# EAGLE design WM (EAGLE 8.1.0)

## Sheet 1 of 3
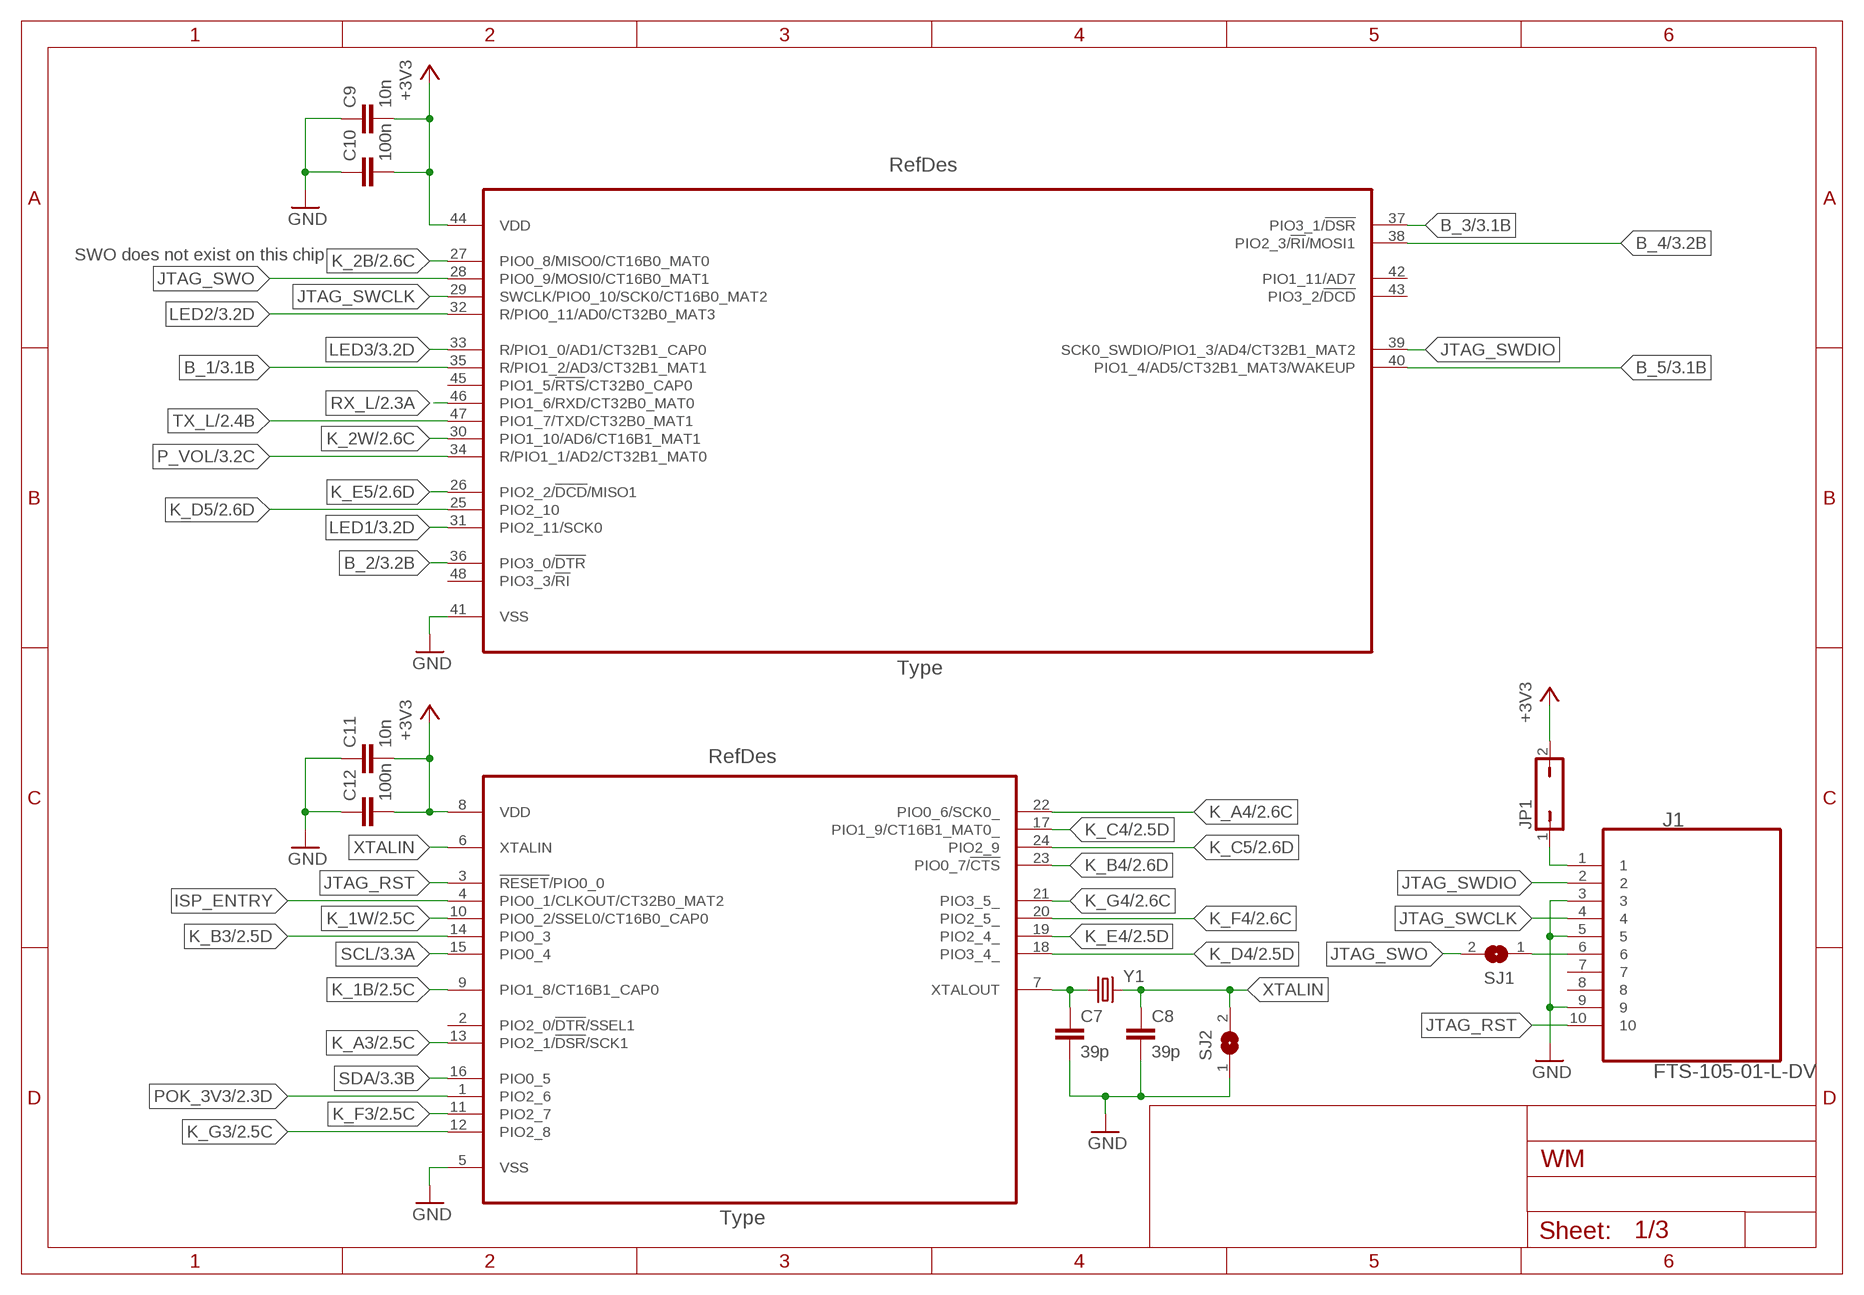
[diagram p0: schematic, sheet 1]

### Parts
C7  39p  C-EUC0805  [C0805]
C8  39p  C-EUC0805  [C0805]
C9  10n  C-EUC0805  [C0805]
C10  100n  C-EUC0805  [C0805]
C11  10n  C-EUC0805  [C0805]
C12  100n  C-EUC0805  [C0805]
J1  FTS-105-01-L-DV  [SAMTEC_FTS-105-01-L-DV]
JP1  JP1Q  [JP1]
SJ1  SJ  [SJ]
SJ2  SJ  [SJ]
U1  LPC1113FBD48/302,1  [QFP50P900X900X160-48N]
Y1  CRYSTALHC49UP  [HC49UP]

### Nets
+3V3: C9.2 C10.2 C11.2 C12.2 JP1.2 U1.8(A:VDD) U1.44(B:VDD) ; also sheet 2,3
B_1: U1.35(B:R/PIO1_2/AD3/CT32B1_MAT1) ; also sheet 3
B_2: U1.36(B:PIO3_0/!DTR!) ; also sheet 3
B_3: U1.37(B:PIO3_1/!DSR!) ; also sheet 3
B_4: U1.38(B:PIO2_3/!RI!/MOSI1) ; also sheet 3
B_5: U1.40(B:PIO1_4/AD5/CT32B1_MAT3/WAKEUP) ; also sheet 3
GND: C7.2 C8.2 C9.1 C10.1 C11.1 C12.1 J1.3 J1.5 J1.9 SJ2.1 U1.5(A:VSS) U1.41(B:VSS) ; also sheet 2,3
ISP_ENTRY: U1.4(A:PIO0_1/CLKOUT/CT32B0_MAT2)
JTAG_RST: J1.10 U1.3(A:!RESET!/PIO0_0)
JTAG_SWCLK: J1.4 U1.29(B:SWCLK/PIO0_10/SCK0/CT16B0_MAT2)
JTAG_SWDIO: J1.2 U1.39(B:SCK0_SWDIO/PIO1_3/AD4/CT32B1_MAT2)
JTAG_SWO: SJ1.2 U1.28(B:PIO0_9/MOSI0/CT16B0_MAT1)
K_1B: U1.9(A:PIO1_8/CT16B1_CAP0) ; also sheet 2,3
K_1W: U1.10(A:PIO0_2/SSEL0/CT16B0_CAP0) ; also sheet 2,3
K_2B: U1.27(B:PIO0_8/MISO0/CT16B0_MAT0) ; also sheet 2,3
K_2W: U1.30(B:PIO1_10/AD6/CT16B1_MAT1) ; also sheet 2,3
K_A3: U1.13(A:PIO2_1/!DSR!/SCK1) ; also sheet 2,3
K_A4: U1.22(A:PIO0_6/SCK0_) ; also sheet 2,3
K_B3: U1.14(A:PIO0_3) ; also sheet 2,3
K_B4: U1.23(A:PIO0_7/!CTS!) ; also sheet 2,3
K_C4: U1.17(A:PIO1_9/CT16B1_MAT0_) ; also sheet 2,3
K_C5: U1.24(A:PIO2_9) ; also sheet 2,3
K_D4: U1.18(A:PIO3_4_) ; also sheet 2,3
K_D5: U1.25(B:PIO2_10) ; also sheet 2,3
K_E4: U1.19(A:PIO2_4_) ; also sheet 2,3
K_E5: U1.26(B:PIO2_2/!DCD!/MISO1) ; also sheet 2,3
K_F3: U1.11(A:PIO2_7) ; also sheet 2,3
K_F4: U1.20(A:PIO2_5_) ; also sheet 2,3
K_G3: U1.12(A:PIO2_8) ; also sheet 2,3
K_G4: U1.21(A:PIO3_5_) ; also sheet 2,3
LED1: U1.31(B:PIO2_11/SCK0) ; also sheet 3
LED2: U1.32(B:R/PIO0_11/AD0/CT32B0_MAT3) ; also sheet 3
LED3: U1.33(B:R/PIO1_0/AD1/CT32B1_CAP0) ; also sheet 3
N$13: C7.1 U1.7(A:XTALOUT) Y1.1
N$15: J1.1 JP1.1
N$16: J1.6 SJ1.1
P_VOL: U1.34(B:R/PIO1_1/AD2/CT32B1_MAT0) ; also sheet 3
POK_3V3: U1.1(A:PIO2_6) ; also sheet 2
RX_L: U1.46(B:PIO1_6/RXD/CT32B0_MAT0) ; also sheet 2
SCL: U1.15(A:PIO0_4) ; also sheet 3
SDA: U1.16(A:PIO0_5) ; also sheet 3
TX_L: U1.47(B:PIO1_7/TXD/CT32B0_MAT1) ; also sheet 2
XTALIN: C8.1 SJ2.2 U1.6(A:XTALIN) Y1.2
Unconnected: J1.7 J1.8 U1.2(A:PIO2_0/!DTR!/SSEL1) U1.42(B:PIO1_11/AD7) U1.43(B:PIO3_2/!DCD!) U1.45(B:PIO1_5/!RTS!/CT32B0_CAP0) U1.48(B:PIO3_3/!RI!)

### Notes on the sheet
- SWO does not exist on this chip

## Sheet 2 of 3
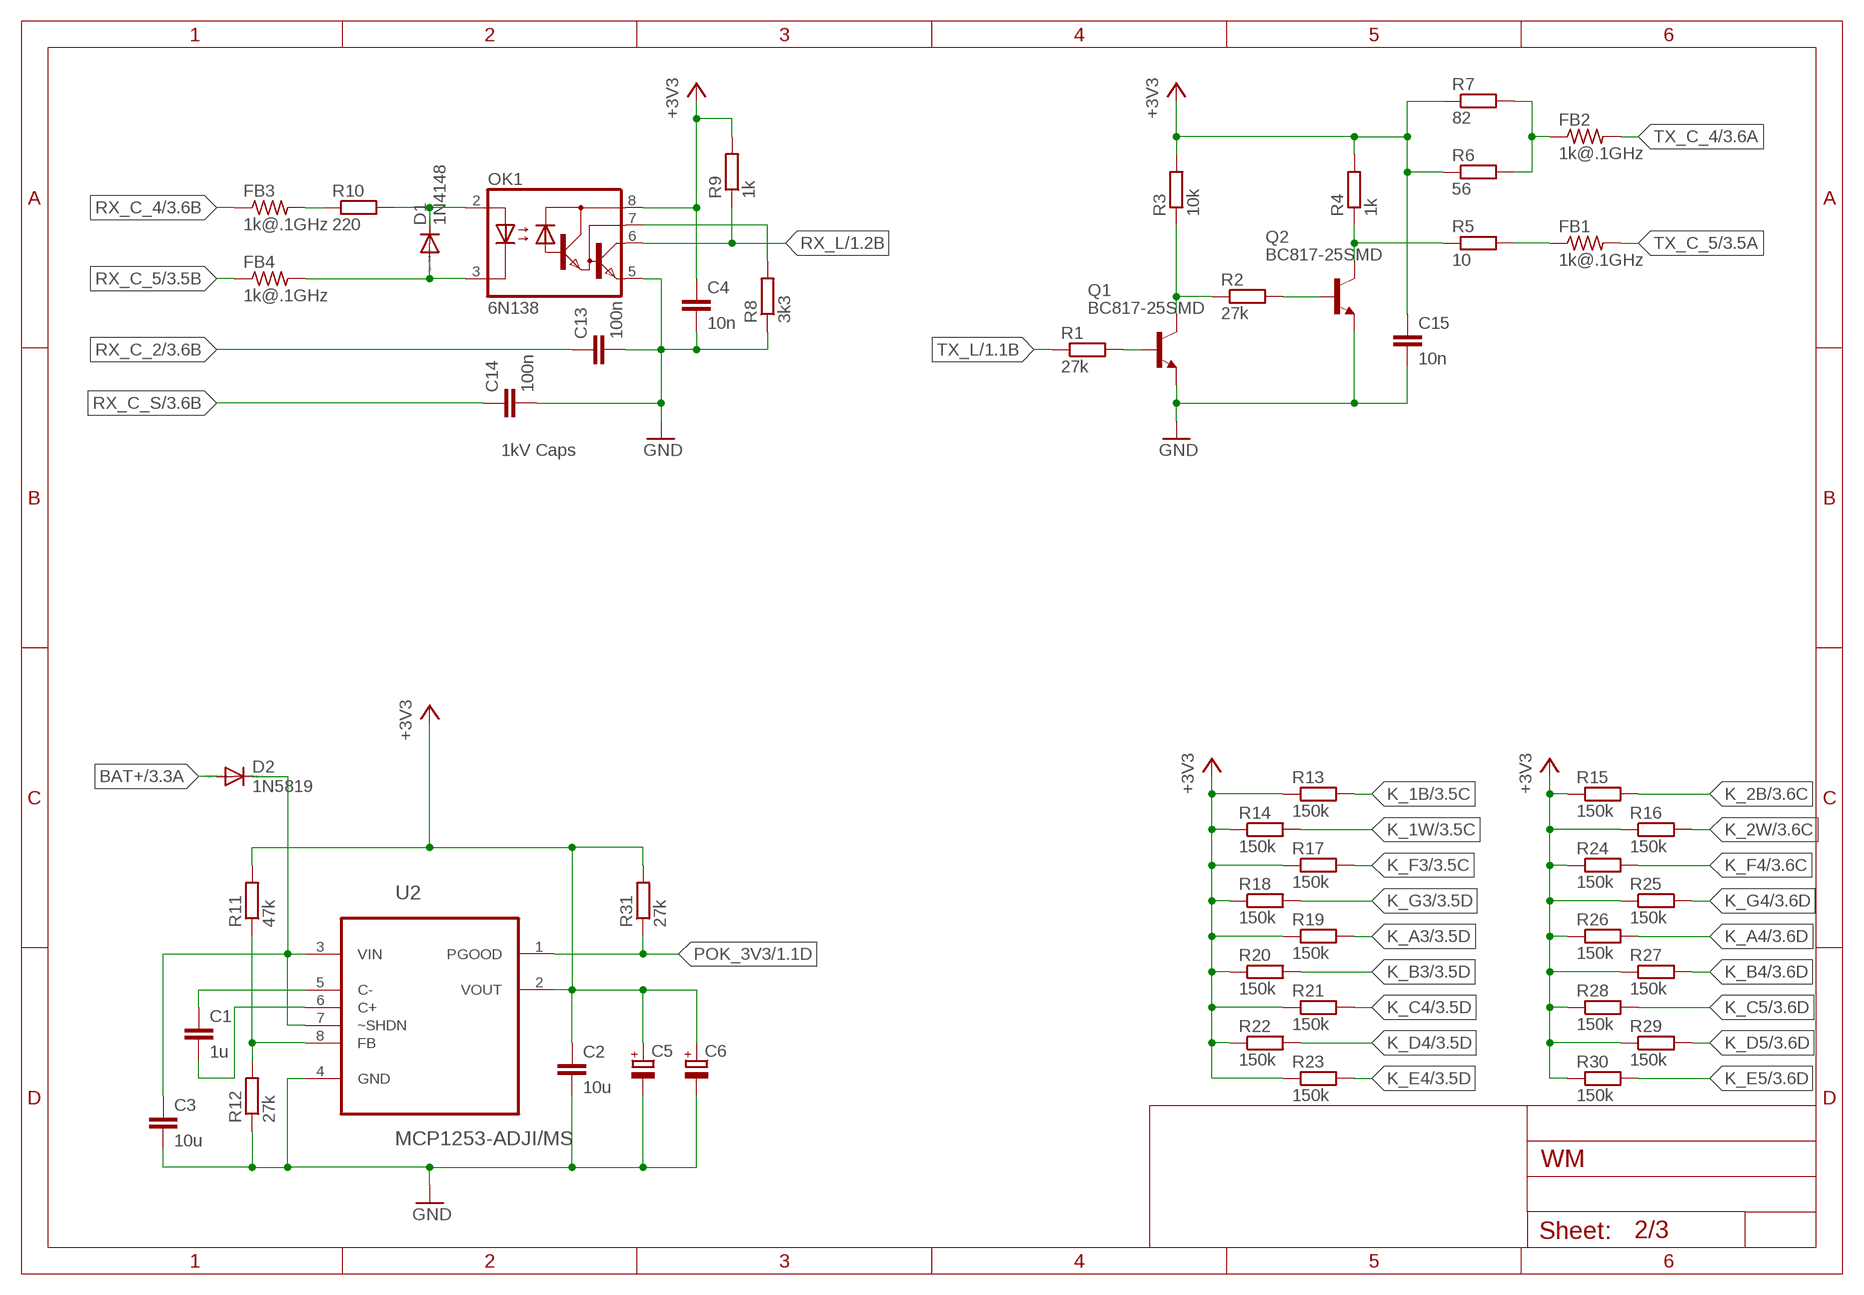
[diagram p1: schematic, sheet 2]

### Parts
C1  1u  C-EUC0805  [C0805]
C2  10u  C-EUC0805  [C0805]
C3  10u  C-EUC0805  [C0805]
C4  10n  C-EUC0805  [C0805]
C5  CPOL-EUE2.5-6  [E2,5-6]
C6  CPOL-EUE2.5-6  [E2,5-6]
C13  100n  C-EUC1210K  [C1210K]
C14  100n  C-EUC1210K  [C1210K]
C15  10n  C-EUC0805  [C0805]
D1  1N4148  DIODE-SOD323-R  [SOD323-R]
D2  1N5819  DIODE-SOD123  [SOD123]
FB1  1k@.1GHz  R-US_R0805  [R0805]
FB2  1k@.1GHz  R-US_R0805  [R0805]
FB3  1k@.1GHz  R-US_R0805  [R0805]
FB4  1k@.1GHz  R-US_R0805  [R0805]
OK1  6N138  [DIL08]
Q1  BC817-25SMD  [SOT23-BEC]
Q2  BC817-25SMD  [SOT23-BEC]
R1  27k  R-EU_R0805  [R0805]
R2  27k  R-EU_R0805  [R0805]
R3  10k  R-EU_R0805  [R0805]
R4  1k  R-EU_R0805  [R0805]
R5  10  R-EU_R0805  [R0805]
R6  56  R-EU_R0805  [R0805]
R7  82  R-EU_R0805  [R0805]
R8  3k3  R-EU_R0805  [R0805]
R9  1k  R-EU_R0805  [R0805]
R10  220  R-EU_R0805  [R0805]
R11  47k  R-EU_R0805  [R0805]
R12  27k  R-EU_R0805  [R0805]
R13  150k  R-EU_R0805  [R0805]
R14  150k  R-EU_R0805  [R0805]
R15  150k  R-EU_R0805  [R0805]
R16  150k  R-EU_R0805  [R0805]
R17  150k  R-EU_R0805  [R0805]
R18  150k  R-EU_R0805  [R0805]
R19  150k  R-EU_R0805  [R0805]
R20  150k  R-EU_R0805  [R0805]
R21  150k  R-EU_R0805  [R0805]
R22  150k  R-EU_R0805  [R0805]
R23  150k  R-EU_R0805  [R0805]
R24  150k  R-EU_R0805  [R0805]
R25  150k  R-EU_R0805  [R0805]
R26  150k  R-EU_R0805  [R0805]
R27  150k  R-EU_R0805  [R0805]
R28  150k  R-EU_R0805  [R0805]
R29  150k  R-EU_R0805  [R0805]
R30  150k  R-EU_R0805  [R0805]
R31  27k  R-EU_R0805  [R0805]
U2  MCP1253-ADJI/MS  [SOP65P490X118-8N]

### Nets
+3V3: C2.1 C4.1 C5.+ C6.+ C15.1 OK1.8(VCC) R3.2 R4.2 R6.1 R7.1 R9.2 R11.2 R13.1 R14.1 R15.1 R16.1 R17.1 R18.1 R19.1 R20.1 R21.1 R22.1 R23.1 R24.1 R25.1 R26.1 R27.1 R28.1 R29.1 R30.1 R31.2 U2.2(VOUT) ; also sheet 1,3
BAT+: D2.A ; also sheet 3
GND: C2.2 C3.2 C4.2 C5.- C6.- C13.2 C14.2 C15.2 OK1.5(GND) Q1.E Q2.E R8.1 R12.1 U2.4(GND) ; also sheet 1,3
K_1B: R13.2 ; also sheet 1,3
K_1W: R14.2 ; also sheet 1,3
K_2B: R15.2 ; also sheet 1,3
K_2W: R16.2 ; also sheet 1,3
K_A3: R19.2 ; also sheet 1,3
K_A4: R26.2 ; also sheet 1,3
K_B3: R20.2 ; also sheet 1,3
K_B4: R27.2 ; also sheet 1,3
K_C4: R21.2 ; also sheet 1,3
K_C5: R28.2 ; also sheet 1,3
K_D4: R22.2 ; also sheet 1,3
K_D5: R29.2 ; also sheet 1,3
K_E4: R23.2 ; also sheet 1,3
K_E5: R30.2 ; also sheet 1,3
K_F3: R17.2 ; also sheet 1,3
K_F4: R24.2 ; also sheet 1,3
K_G3: R18.2 ; also sheet 1,3
K_G4: R25.2 ; also sheet 1,3
N$1: Q1.B R1.2
N$2: Q1.C R2.1 R3.1
N$3: Q2.B R2.2
N$4: Q2.C R4.1 R5.1
N$5: OK1.7(VB) R8.2
N$6: C1.1 U2.5(C-)
N$7: D1.C OK1.2(A) R10.2
N$8: C1.2 U2.6(C+)
N$10: R11.1 R12.2 U2.8(FB)
N$17: FB3.2 R10.1
N$18: D1.A FB4.2 OK1.3(C)
N$19: FB1.1 R5.2
POK_3V3: R31.1 U2.1(PGOOD) ; also sheet 1
RX_C_2: C13.1 ; also sheet 3
RX_C_4: FB3.1 ; also sheet 3
RX_C_5: FB4.1 ; also sheet 3
RX_C_S: C14.1 ; also sheet 3
RX_L: OK1.6(VO) R9.1 ; also sheet 1
TX_C_4: FB2.2 ; also sheet 3
TX_C_5: FB1.2 ; also sheet 3
TX_H_H: FB2.1 R6.2 R7.2
TX_L: R1.1 ; also sheet 1
UNREG+: C3.1 D2.C U2.3(VIN) U2.7(~SHDN)

### Notes on the sheet
- 1kV Caps

## Sheet 3 of 3
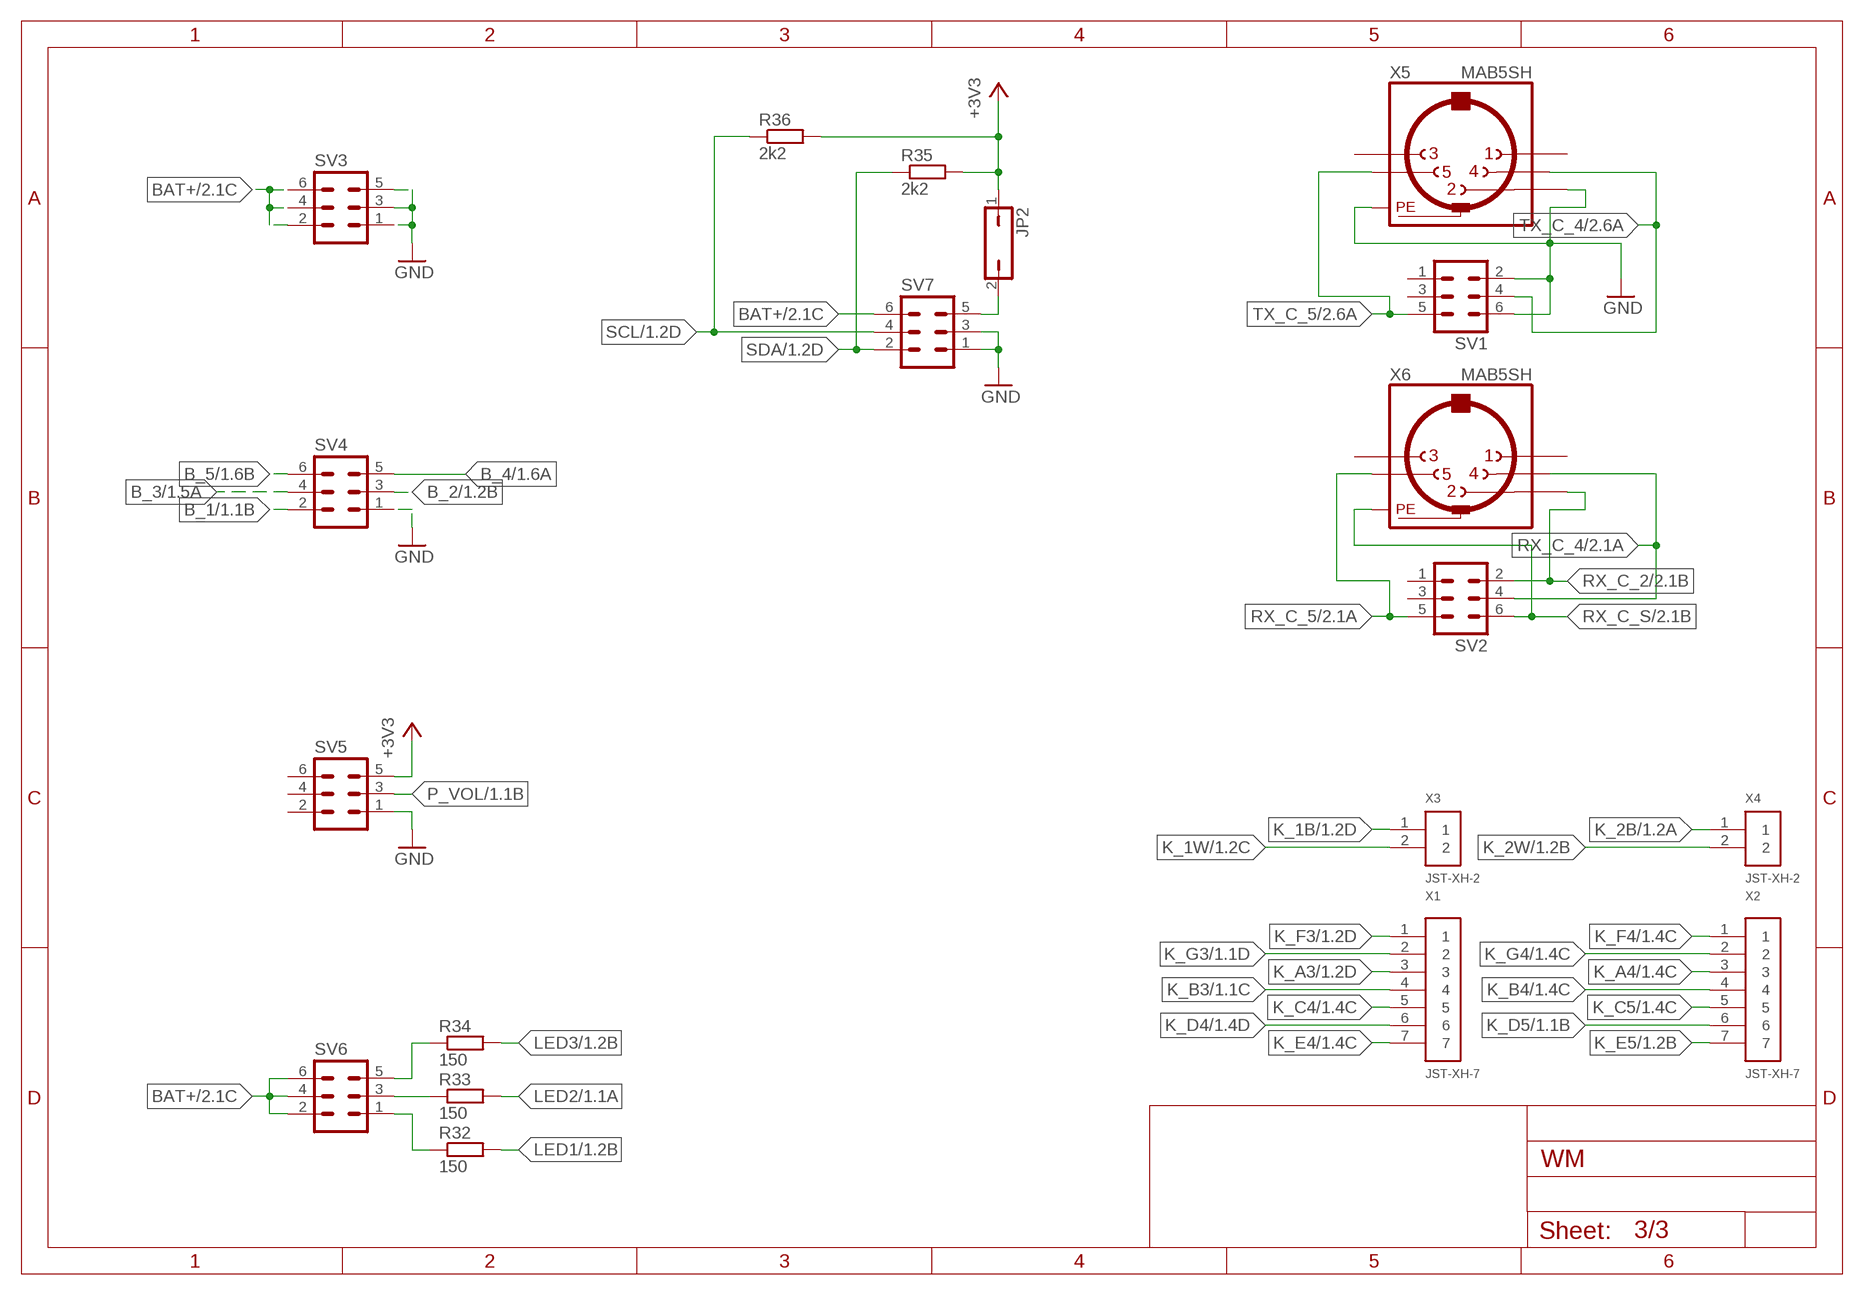
[diagram p2: schematic, sheet 3]

### Parts
JP2  JP1Q  [JP1]
R32  150  R-EU_R0805  [R0805]
R33  150  R-EU_R0805  [R0805]
R34  150  R-EU_R0805  [R0805]
R35  2k2  R-EU_R0805  [R0805]
R36  2k2  R-EU_R0805  [R0805]
SV1  ML6  [ML6]
SV2  ML6  [ML6]
SV3  ML6  [ML6]
SV4  ML6  [ML6]
SV5  ML6  [ML6]
SV6  ML6  [ML6]
SV7  ML6  [ML6]
X1  JST-XH-7  [JST-XH-7]
X2  JST-XH-7  [JST-XH-7]
X3  JST-XH-2  [JST-XH-2]
X4  JST-XH-2  [JST-XH-2]
X5  MAB5SH  [MAB5SH]
X6  MAB5SH  [MAB5SH]

### Nets
+3V3: JP2.1 R35.2 R36.2 SV5.5 ; also sheet 1,2
B_1: SV4.2 ; also sheet 1
B_2: SV4.3 ; also sheet 1
B_3: SV4.4 ; also sheet 1
B_4: SV4.5 ; also sheet 1
B_5: SV4.6 ; also sheet 1
BAT+: SV3.2 SV3.4 SV3.6 SV6.2 SV6.4 SV6.6 SV7.6 ; also sheet 2
GND: SV1.2 SV1.6 SV3.1 SV3.3 SV3.5 SV4.1 SV5.1 SV7.1 SV7.3 X5.2 X5.PE X5.PE@(PE) ; also sheet 1,2
K_1B: X3.1 ; also sheet 1,2
K_1W: X3.2 ; also sheet 1,2
K_2B: X4.1 ; also sheet 1,2
K_2W: X4.2 ; also sheet 1,2
K_A3: X1.3 ; also sheet 1,2
K_A4: X2.3 ; also sheet 1,2
K_B3: X1.4 ; also sheet 1,2
K_B4: X2.4 ; also sheet 1,2
K_C4: X1.5 ; also sheet 1,2
K_C5: X2.5 ; also sheet 1,2
K_D4: X1.6 ; also sheet 1,2
K_D5: X2.6 ; also sheet 1,2
K_E4: X1.7 ; also sheet 1,2
K_E5: X2.7 ; also sheet 1,2
K_F3: X1.1 ; also sheet 1,2
K_F4: X2.1 ; also sheet 1,2
K_G3: X1.2 ; also sheet 1,2
K_G4: X2.2 ; also sheet 1,2
LED1: R32.2 ; also sheet 1
LED2: R33.2 ; also sheet 1
LED3: R34.2 ; also sheet 1
N$9: R34.1 SV6.5
N$11: R33.1 SV6.3
N$12: R32.1 SV6.1
N$14: JP2.2 SV7.5
P_VOL: SV5.3 ; also sheet 1
RX_C_2: SV2.2 X6.2 ; also sheet 2
RX_C_4: SV2.4 X6.4 ; also sheet 2
RX_C_5: SV2.5 X6.5 ; also sheet 2
RX_C_S: SV2.6 X6.PE X6.PE@(PE) ; also sheet 2
SCL: R36.1 SV7.4 ; also sheet 1
SDA: R35.1 SV7.2 ; also sheet 1
TX_C_4: SV1.4 X5.4 ; also sheet 2
TX_C_5: SV1.5 X5.5 ; also sheet 2
Unconnected: SV1.1 SV1.3 SV2.1 SV2.3 SV5.2 SV5.4 SV5.6 X5.1 X5.3 X6.1 X6.3

## Library data of the parts
C1-C4 C7 C8 C13-C15 = resistor:C-EU: CAPACITOR, European symbol
C5 C6 = resistor:CPOL-EU: POLARIZED CAPACITOR, European symbol
C9-C12 = rcl:C-EU: CAPACITOR, European symbol
D1 D2 = diode:DIODE-: DIODE
FB1-FB4 = resistor:R-US_: RESISTOR, American symbol
J1 = WM_Parts:FTS-105-01-L-DV; DESCRIPTION: Through Hole Post Header; MPN: FTS-105-01-L-DV; OC_FARNELL: 1667729; OC_NEWARK: 11P4653; PACKAGE: CONN HEADER 10POS DUAL .05" SMD; SUPPLIER: Samtec
JP1 JP2 = jumper:JP1Q: JUMPER
OK1 = optocoupler:6N138: MOTOROLA OPTO COUPLER; MF: VISHAY/TELEFUNKEN; MPN: 6N138; OC_FARNELL: 9860150; OC_NEWARK: 35K5294
Q1 Q2 = transistor-npn:BC817*: NPN Transistor
R1-R10 R31-R36 = resistor:R-EU_: RESISTOR, European symbol
R11-R30 = rcl:R-EU_: RESISTOR, European symbol
SJ1 SJ2 = jumper:SJ: SMD solder JUMPER
SV1-SV7 = con-harting-ml:ML6: HARTING; OC_FARNELL: unknown; OC_NEWARK: unknown
U1 = WM_Parts:LPC1113FBD48/302,1: Embedded - Microcontrollers,LQFP-48; MPN: LPC1113FBD48/302,1; OC_FARNELL: 2072186; OC_NEWARK: 83T7137; PACKAGE: LQFP-48; SUPPLIER: NXP
U2 = WM_Parts:MCP1253-ADJI/MS: Low Noise, Positive-Regulated Charge Pump; MPN: MCP1253-ADJI/MS; OC_FARNELL: 1332068; OC_NEWARK: 03H5059; PACKAGE: SOP-8; SUPPLIER: Microchip
X1 X2 = WM_Parts:JST-XH-7: 2.5mm Header - 7 Pin; MF: MOLEX; MPN: 22-23-2071; OC_FARNELL: 1654534; OC_NEWARK: 56H0445
X3 X4 = WM_Parts:JST-XH-2: 2.5mm Header - 2 Pin
X5 X6 = con-hirschmann:MAB5SH: Female CONNECTOR 5 pins 90 deg. with shield, horizontal (DIN 41524); OC_FARNELL: 809883; OC_NEWARK: unknown
Y1 = crystal:CRYSTAL: CRYSTAL; OC_FARNELL: unknown; OC_NEWARK: unknown

## Board
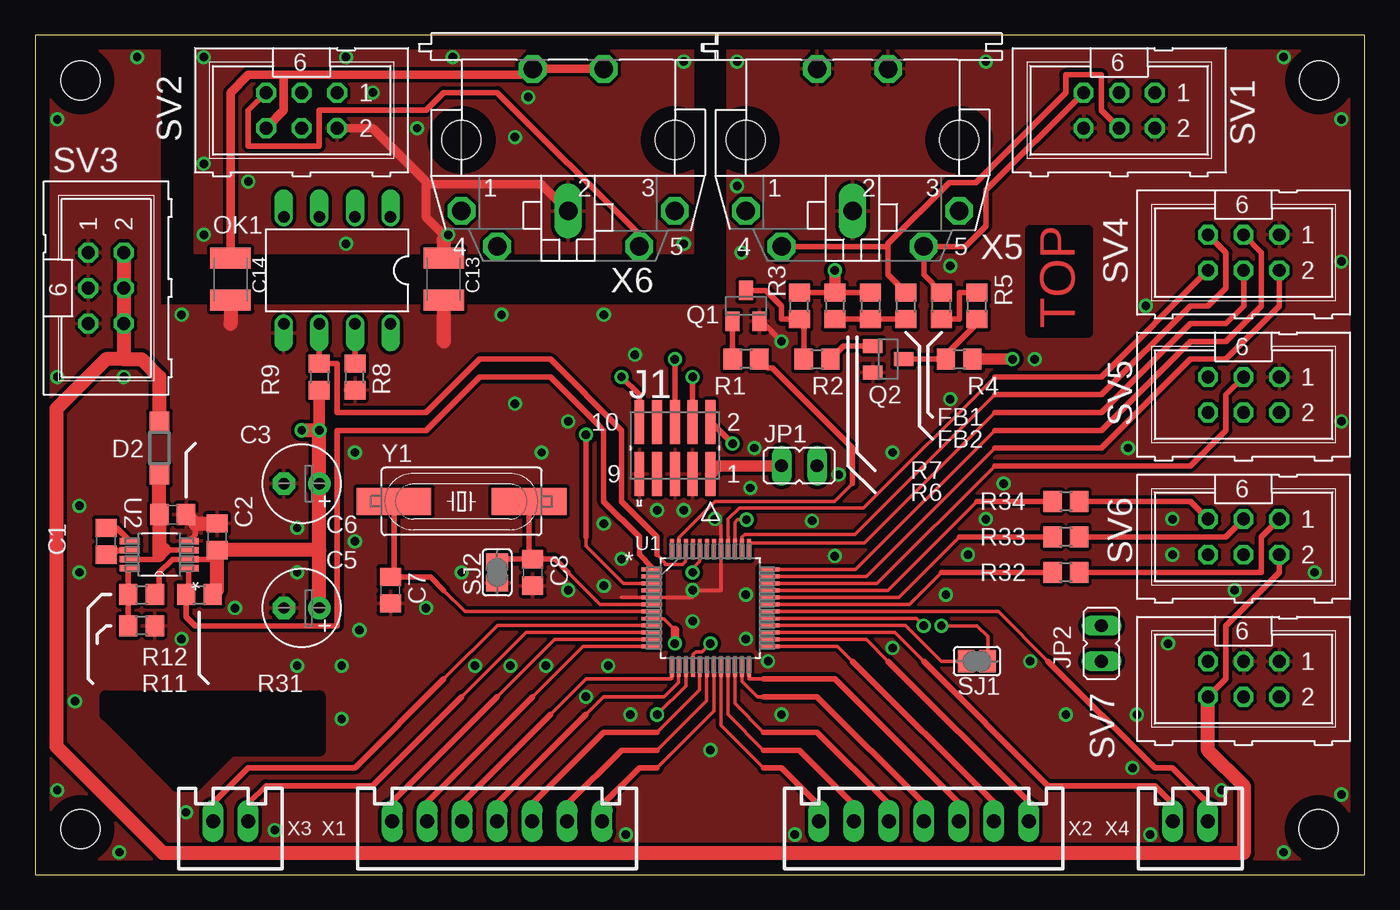
[diagram p3: board, top side]
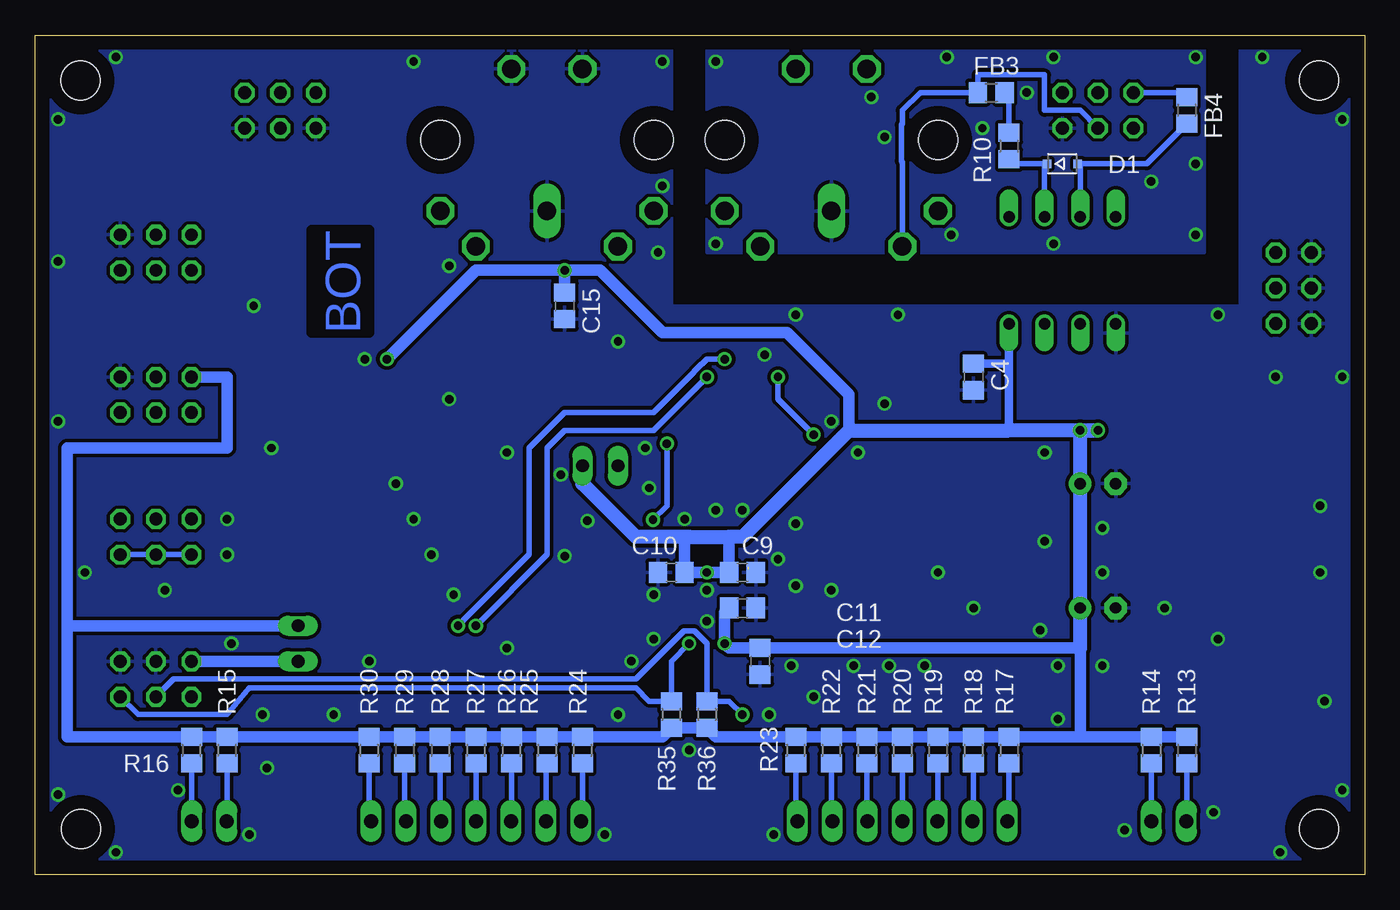
[diagram p4: board, bottom side, seen from below]

Size 95 x 60 mm. Coordinates in mm from the lower left corner, seen from the top.
Outline: 0,0 95,0 95,60 0,60 0,0
Copper layers (1*16): Top 0.035mm / dielectric 1.5mm / Bottom 0.035mm
Design rules "default": minimum track width 10mil, minimum drill 24mil, track to track 8mil, track to pad 8mil, pad to pad 8mil, via to via 8mil, smd to smd 8mil, copper to edge 40mil, drill to drill 8mil, minimum pad ring 10mil, minimum via ring 8mil, stop-mask expansion 4mil, vias tented up to drill 0mil, thermal gap 10mil
Holes 2.8 mm at 3.25,3.25 3.25,56.75 91.75,56.75 91.72,3.25
tRestrict: 11 lines
bRestrict: 4 lines

### Footprints (pad centres in the part's own frame; a part is rotated, then mirrored left to right if it is on the bottom)
C0805 = smd 1.3 x 1.5: 1 -0.95,0; 2 0.95,0
E2,5-6 = drill 0.813 pad 1.6: + -1.27,0 | drill 0.813 pad 1.6 octagon: - 1.27,0
C1210K = smd 1.5 x 2.9: 1 -1.5,0; 2 1.5,0
SOD323-R = smd 0.6 x 0.6: A 1.1,0; C -1.1,0
SOD123 = smd 1.4 x 1.4: A 1.9,0; C -1.9,0
R0805 = smd 1.3 x 1.5: 1 -0.95,0; 2 0.95,0
SAMTEC_FTS-105-01-L-DV = smd 0.711 x 3.124: 1 2.54,-1.854; 2 2.54,1.854; 3 1.27,-1.854; 4 1.27,1.854; 5 0,-1.854; 6 0,1.854; 7 -1.27,-1.854; 8 -1.27,1.854; 9 -2.54,-1.854; 10 -2.54,1.854
JP1 = drill 0.914 long: 1 0,-1.27; 2 0,1.27
DIL08 = drill 0.813 offset: 1 -3.81,-3.81; 2 -1.27,-3.81; 3 1.27,-3.81; 4 3.81,-3.81; 5 3.81,3.81; 6 1.27,3.81; 7 -1.27,3.81; 8 -3.81,3.81
SOT23-BEC = smd 1 x 1.4: B -0.95,-1.1; C 0,1.1; E 0.95,-1.1
SJ = smd 1.168 x 1.6: 1 -0.762,0; 2 0.762,0
ML6 = drill 0.914 octagon: 1 -2.54,-1.27; 2 -2.54,1.27; 3 0,-1.27; 4 0,1.27; 5 2.54,-1.27; 6 2.54,1.27
QFP50P900X900X160-48N = smd 1.473 x 0.279: 1 -4.191,2.743; 2 -4.191,2.261; 3 -4.191,1.753; 4 -4.191,1.245; 5 -4.191,0.762; 6 -4.191,0.254; 7 -4.191,-0.254; 8 -4.191,-0.762; 9 -4.191,-1.245; 10 -4.191,-1.753; 11 -4.191,-2.261; 12 -4.191,-2.743; 25 4.191,-2.743; 26 4.191,-2.261; 27 4.191,-1.753; 28 4.191,-1.245; 29 4.191,-0.762; 30 4.191,-0.254; 31 4.191,0.254; 32 4.191,0.762; 33 4.191,1.245; 34 4.191,1.753; 35 4.191,2.261; 36 4.191,2.743 | smd 0.279 x 1.473: 13 -2.743,-4.191; 14 -2.261,-4.191; 15 -1.753,-4.191; 16 -1.245,-4.191; 17 -0.762,-4.191; 18 -0.254,-4.191; 19 0.254,-4.191; 20 0.762,-4.191; 21 1.245,-4.191; 22 1.753,-4.191; 23 2.261,-4.191; 24 2.743,-4.191; 37 2.743,4.191; 38 2.261,4.191; 39 1.753,4.191; 40 1.245,4.191; 41 0.762,4.191; 42 0.254,4.191; 43 -0.254,4.191; 44 -0.762,4.191; 45 -1.245,4.191; 46 -1.753,4.191; 47 -2.261,4.191; 48 -2.743,4.191
SOP65P490X118-8N = smd 1.422 x 0.457: 1 -2.108,0.965; 2 -2.108,0.33; 3 -2.108,-0.33; 4 -2.108,-0.965; 5 2.108,-0.965; 6 2.108,-0.33; 7 2.108,0.33; 8 2.108,0.965
JST-XH-7 = drill 1 long: 1 -7.5,0; 2 -5,0; 3 -2.5,0; 4 0,0; 5 2.5,0; 6 5,0; 7 7.5,0
JST-XH-2 = drill 1 long: 1 -1.25,0; 2 1.25,0
MAB5SH = drill 1.321 octagon: 1 7.62,5.08; 3 -7.62,5.08; 4 5.08,7.62; 5 -5.08,7.62; PE -2.54,-5.08; PE@ 2.54,-5.08 | drill 1.321 long: 2 0,5.08 | hole 2.794: 7.62,0; -7.62,0
HC49UP = smd 5.334 x 1.93: 1 -4.826,0; 2 4.826,0

### Placement (x,y rotation side)
C1  5.08,23.81 270 top
C2  13.02,24.13 90 top
C3  9.84,25.72 0 top
C4  27.94,35.56 270 bottom
C5  19.05,19.05 180 top
C6  19.05,27.94 180 top
C7  25.4,20.32 270 top
C8  35.56,21.59 270 top
C9  44.45,21.59 180 bottom
C10  49.53,21.59 0 bottom
C11  44.45,19.05 180 bottom
C12  43.18,15.24 90 bottom
C13  29.21,42.55 270 top
C14  13.97,42.55 270 top
C15  57.15,40.64 270 bottom
D1  21.59,50.8 0 bottom
D2  8.89,30.48 90 top
FB1  64.77,40.64 90 top
FB2  62.23,40.64 90 top
FB3  26.67,55.88 0 bottom
FB4  12.7,54.61 270 bottom
J1  45.72,30.48 0 top
JP1  54.61,29.21 270 top
JP2  76.2,16.51 180 top
OK1  21.59,43.18 180 top
Q1  50.8,40.64 0 top
Q2  60.96,36.83 270 top
R1  50.8,36.83 180 top
R2  55.88,36.83 0 top
R3  54.61,40.64 90 top
R4  66.04,36.83 0 top
R5  67.31,40.64 90 top
R6  57.15,40.64 270 top
R7  59.69,40.64 270 top
R8  22.86,35.56 90 top
R9  20.32,35.56 270 top
R10  25.4,52.07 270 bottom
R11  7.62,20 0 top
R12  7.62,17.78 180 top
R13  12.7,8.89 270 bottom
R14  15.24,8.89 270 bottom
R15  81.28,8.89 270 bottom
R16  83.82,8.89 270 bottom
R17  25.4,8.89 270 bottom
R18  27.94,8.89 270 bottom
R19  30.48,8.89 270 bottom
R20  33.02,8.89 270 bottom
R21  35.56,8.89 270 bottom
R22  38.1,8.89 270 bottom
R23  40.64,8.89 270 bottom
R24  55.88,8.89 270 bottom
R25  58.42,8.89 270 bottom
R26  60.96,8.89 270 bottom
R27  63.5,8.89 270 bottom
R28  66.04,8.89 270 bottom
R29  68.58,8.89 270 bottom
R30  71.12,8.89 270 bottom
R31  11.75,20 0 top
R32  73.66,21.59 180 top
R33  73.66,24.13 180 top
R34  73.66,26.67 180 top
R35  49.53,11.43 270 bottom
R36  46.99,11.43 270 bottom
SJ1  67.31,15.24 180 top
SJ2  33.02,21.59 90 top
SV1  77.47,54.61 180 top
SV2  19.05,54.61 180 top
SV3  5.08,41.91 270 top
SV4  86.36,44.45 180 top
SV5  86.36,34.29 180 top
SV6  86.36,24.13 180 top
SV7  86.36,13.97 180 top
U1  48.26,19.05 0 top
U2  8.89,22.86 180 top
X1  33.02,3.81 0 top
X2  63.5,3.81 0 top
X3  13.97,3.81 0 top
X4  82.55,3.81 0 top
X5  58.42,52.5 180 top
X6  38.1,52.5 180 top
Y1  30.48,26.67 0 top

### Tracks (layer width: path | path; a pad name or v marks a point on that pad's centre or on a via)
+3V3  (via drill 0.6)
  Top 0.254: U1.8 44.08,18.27 44.94,18.27 45.72,17.5 | U1.44 47.48,23.23 47.48,22.37 46.99,21.87 v46.99,21.59
  Top 0.406: R7.1 C15.1 R3.2 | R11.2 8.89,20.64 8.89,21.59 9.83,22.53 U2.2 12.37,22.53 C2.1
  Top 0.61: v45.72,16.51 45.72,17.5
  Top 0.813: R9.2 v20.32,31.75 | C15.1 v57.15,43.18 | v69.85,36.83 R4.2
  Top 1.016: R31.2 13.02,20.32 C2.1 20.32,23.18 | C5.+ 20.32,23.18 | 20.32,23.18 C6.+ v20.32,31.75 v19.05,31.75
  Bottom 0.61: C11.2 45.72,19.05 | 45.72,21.91 C9.2 | 25.4,36.51 OK1.8 | 25.4,36.51 25.4,31.75 | C4.1 25.4,36.51
  Bottom 0.813: R13.1 R14.1 20.32,9.84 | 20.32,9.84 R17.1 R18.1 R19.1 R20.1 R21.1 R22.1 R23.1 46.35,9.84 R36.2 R35.2 50.17,9.84 R24.1 R25.1 R26.1 R27.1 R28.1 R29.1 R30.1 R15.1 R16.1 92.71,9.84 92.71,17.78 | C11.2 45.72,18.73 v45.72,16.51 45.4,16.19 C12.2 20.32,16.19 20.32,9.84 | 45.4,24.13 C9.2 v46.99,21.59 C10.2 48.58,24.13 48.26,24.13 | SV5.5 81.28,35.56 81.28,30.48 92.71,30.48 92.71,17.78 | v57.15,43.18 63.5,43.18 v69.85,36.83 | v57.15,43.18 54.61,43.18 50.16,38.73 41.27,38.73 36.83,34.29 36.83,31.75 | v57.15,43.18 C15.1 | 92.71,17.78 JP2.1
  Bottom 1.016: 20.32,16.19 v20.32,31.75 v19.05,31.75 25.4,31.75 36.83,31.75 44.45,24.13 45.4,24.13 48.26,24.13 52.07,24.13 55.88,27.94 JP1.2
B_1
  Top 0.254: U1.35 59.41,21.31 68.58,30.48
  Top 0.406: SV4.2 88.9,40.64 85.09,36.83 82.55,36.83 76.2,30.48 68.58,30.48
B_2
  Top 0.254: U1.36 58.62,21.79 68.58,31.75
  Top 0.406: SV4.3 87.63,44.45 87.63,40.64 85.09,38.1 82.55,38.1 76.2,31.75 68.58,31.75
B_3
  Top 0.254: 68.58,33.02 59.25,23.69 51,23.69 U1.37
  Top 0.406: SV4.4 86.36,40.64 85.09,39.37 82.55,39.37 76.2,33.02 68.58,33.02
B_4
  Top 0.254: U1.38 50.53,23.25 50.53,24.11 50.73,24.31 58.6,24.31 68.58,34.29
  Top 0.406: SV4.5 85.09,44.45 85.09,41.91 83.82,40.64 82.55,40.64 76.2,34.29 68.58,34.29
B_5
  Top 0.254: U1.40 49.54,23.28 49.54,24.17 | 49.54,24.17 49.55,24.18 | 68.58,35.56 59.21,26.19 50.32,26.19 49.53,25.4 49.53,24.18 49.54,24.17
  Top 0.406: SV4.6 76.2,35.56 68.58,35.56
BAT+
  Top 0.406: SV7.6 85.09,13.97 85.09,17.78 88.9,21.59 SV6.2
  Top 1.016: SV7.6 83.82,8.89 86.36,6.35 86.36,1.52 9.14,1.52 1.52,9.14 1.52,33.27 5.08,36.83 6.35,36.83 | SV3.2 SV3.4 SV3.6 6.35,36.83 | 6.35,36.83 7.62,36.83 8.89,35.56 D2.A
  Bottom 0.406: SV6.2 SV6.4 SV6.6
GND  (via drill 0.6)
  Top 0.254: 41.91,19.81 U1.5 46.99,19.81 v46.99,20.32 49.02,20.32 U1.41 49.02,24.96 v48.58,25.4
  Top 0.406: Q1.E 51.9,39.54 v53.34,38.1 | U2.4 11.43,24.26 11.43,25.08
  Top 1.016: C3.2 11.43,25.08 C2.2 | C13.2 29.21,38.1 | C14.2 13.97,39.37
  other vias: 78.74,11.43 53.34,11.43 38.1,20.32 30.48,21.59 27.94,19.05 73.66,11.43 71.12,15.24 6.35,35.56 1.59,35.56 3.17,26.35 3.17,21.59 1.59,6.03 6.03,1.59 17.14,3.17 42.23,2.86 79.69,2.86 89.22,1.59 93.34,5.71 93.34,53.98 89.22,58.42 1.59,53.98 57.15,22.76 52.39,15.24 33.97,14.92 48.26,8.89 54.29,2.86 61.28,16.19 78.42,7.62 69.22,27.94 7.3,58.42 2.86,12.38 36.51,14.92 40.96,14.92 39.37,12.7 42.55,11.43 31.43,14.92 66.67,22.86 67.94,25.4 81.28,25.4 81.28,22.86 65.09,20 10.48,40.01 33.34,40.01 40.64,40.01 50.48,44.45 50.16,49.21 50.16,58.1 67.94,58.1 93.34,43.81 93.34,32.38 91.44,21.59 85.72,20.32 84.77,6.03 21.91,11.11 21.91,14.92 23.18,17.46 22.86,30.16 40.64,20.64 40.64,25.08 46.99,18.1 50.8,16.83 50.8,20 18.73,24.77 18.73,21.59 22.86,23.81 44.45,26.04 46.35,26.04 51.12,27.62 57.43,28.57 51.4,30.48 55.52,25.27 18.73,14.92 10.79,4.45 41.91,22.54 36.2,30.16 34.29,33.66 14.29,19.05 10.48,16.83 38.1,32.38 42.86,37.15 80.96,16.51 61.28,30.16 65.41,33.97 71.44,36.83 79.38,40.64 65.41,43.5 78.11,30.48
  pour Top (isolate 0.254): 0,0 95.25,0 95.25,59.69 49.53,59.69 49.53,40.64 8.89,40.64 8.89,59.69 0,59.69
  pour Bottom (isolate 0.254): 0,0 95.25,0 95.25,59.69 49.53,59.69 49.53,40.64 8.89,40.64 8.89,59.69 0,59.69
JTAG_RST  (via drill 0.6)
  Top 0.254: U1.3 42.06,20.8 39.37,23.5 39.37,24.13
  Top 0.406: J1.10 43.18,34.29 v41.91,35.56 | 39.37,24.13 v39.37,31.43
  Bottom 0.406: v41.91,35.56 41.91,33.97 v39.37,31.43
JTAG_SWCLK  (via drill 0.6)
  Top 0.254: U1.29 62.99,18.29 v63.5,17.78
  Top 0.406: J1.4 v46.99,35.56
  Bottom 0.406: v63.5,17.78 58.42,22.86 58.42,30.48 57.15,31.75 50.8,31.75 v46.99,35.56
JTAG_SWDIO  (via drill 0.6)
  Top 0.254: U1.39 50.01,25.17 50.2,25.36 v50.84,25.36
  Top 0.406: J1.2 48.31,32.33 v49.85,30.8
  Bottom 0.406: v49.85,30.8 49.85,26.35 v50.84,25.36
JTAG_SWO
  Top 0.254: U1.28 62.2,17.8 64.77,15.24 SJ1.2
K_1B
  Top 0.254: 29.21,13.97 33.05,17.8 U1.9
  Top 0.406: X3.1 12.7,3.83 12.7,5.08 15.24,7.62 22.86,7.62 29.21,13.97
  Bottom 0.406: X3.1 12.7,3.83 R13.2
K_1W
  Top 0.254: 30.48,12.7 35.08,17.3 U1.10
  Top 0.406: X3.2 15.24,3.83 15.24,5.08 16.51,6.35 24.13,6.35 30.48,12.7
  Bottom 0.406: X3.2 15.24,3.83 R14.2
K_2B
  Top 0.254: U1.27 61.44,17.3 63.5,15.24
  Top 0.406: X4.1 81.28,3.83 81.28,5.08 80.01,6.35 72.39,6.35 63.5,15.24
  Bottom 0.406: X4.1 81.28,3.83 R15.2
K_2W
  Top 0.254: U1.30 68.83,18.8 72.39,15.24
  Top 0.406: X4.2 83.82,3.83 83.82,5.08 81.28,7.62 80.01,7.62 72.39,15.24
  Bottom 0.406: X4.2 83.82,3.83 R16.2
K_A3
  Top 0.254: U1.13 45.52,14.03 45.45,13.97 39.37,13.97 36.83,11.43
  Top 0.406: X1.3 30.52,5.12 36.83,11.43
  Bottom 0.406: X1.3 30.48,3.85 R19.2
K_A4
  Top 0.254: 52.07,10.16 50.01,12.22 U1.22
  Top 0.406: 60.96,5.08 60.96,3.85 X2.3 61,5.04 55.88,10.16 52.07,10.16
  Bottom 0.406: X2.3 60.96,3.85 R26.2
K_B3
  Top 0.254: U1.14 45.99,14.85 45.99,13.75 44.94,12.7 40.64,12.7 39.37,11.43
  Top 0.406: 33.02,5.08 X1.4 33.02,5.08 | 33.02,5.08 39.37,11.43
  Bottom 0.406: X1.4 R20.2
K_B4
  Top 0.254: U1.23 50.53,14.85 50.53,13.79 51.63,12.7 52.07,12.7
  Top 0.406: X2.4 63.5,5.08 55.88,12.7 52.07,12.7
  Bottom 0.406: X2.4 R27.2
K_C4
  Top 0.254: U1.17 47.5,13.21 44.45,10.16
  Top 0.406: X1.5 35.56,3.81 35.56,5.08 40.64,10.16 44.45,10.16
  Bottom 0.406: X1.5 35.56,3.85 R21.2
K_C5
  Top 0.254: 52.07,13.97 51,13.97 U1.24
  Top 0.406: X2.5 66,5.12 57.15,13.97 52.07,13.97
  Bottom 0.406: X2.5 66.04,3.85 R28.2
K_D4
  Top 0.254: U1.18 47.97,14.82 47.97,12.41 44.45,8.89
  Top 0.406: X1.6 38.1,3.89 38.1,5.08 41.91,8.89 44.45,8.89
  Bottom 0.406: X1.6 38.1,3.89 R22.2
K_D5
  Top 0.254: U1.25 57.35,16.31 58.42,15.24
  Top 0.406: X2.6 68.58,3.89 68.58,5.08 58.42,15.24
  Bottom 0.406: X2.6 68.58,3.89 R29.2
K_E4
  Top 0.254: 44.45,7.62 48.51,11.68 U1.19
  Top 0.406: X1.7 40.64,3.93 40.64,5.08 43.18,7.62 44.45,7.62
  Bottom 0.406: X1.7 40.64,3.93 R23.2
K_E5
  Top 0.254: U1.26 59.41,16.79 60.96,15.24
  Top 0.406: X2.7 71.12,3.93 71.12,5.08 60.96,15.24
  Bottom 0.406: X2.7 71.12,3.93 R30.2
K_F3
  Top 0.254: 33.02,12.7 37.11,16.79 U1.11
  Top 0.406: X1.1 25.4,3.93 25.4,5.08 33.02,12.7
  Bottom 0.406: X1.1 25.4,3.93 R17.2
K_F4
  Top 0.254: 52.07,7.62 49.02,10.67 U1.20
  Top 0.406: 55.88,5.08 55.88,3.93 X2.1 56,4.96 53.34,7.62 52.07,7.62
  Bottom 0.406: X2.1 55.88,3.93 R24.2
K_G3
  Top 0.254: 35.56,12.7 39.17,16.31 U1.12
  Top 0.406: X1.2 27.94,3.89 27.94,5.08 35.56,12.7
  Bottom 0.406: X1.2 27.94,3.89 R18.2
K_G4
  Top 0.254: 52.07,8.89 49.51,11.46 U1.21
  Top 0.406: 58.42,5.08 58.42,3.89 X2.2 58.5,5 54.61,8.89 52.07,8.89
  Bottom 0.406: R25.2 58.5,7.86 X2.2
LED1
  Top 0.254: U1.31 62.48,19.3 64.77,21.59
  Top 0.406: R32.2 64.77,21.59
LED2
  Top 0.254: U1.32 61.72,19.81 66.04,24.13
  Top 0.406: R33.2 66.04,24.13
LED3
  Top 0.254: U1.33 60.94,20.3 67.31,26.67
  Top 0.406: R34.2 67.31,26.67
N$1
  Top 0.406: R1.2 Q1.B
N$2
  Top 0.406: Q1.C 52.24,41.74 53.34,40.64 53.34,39.69 R3.1 54.93,39.37 R2.1
N$3
  Top 0.406: R2.2 57.78,37.78 Q2.B
N$4
  Top 0.406: Q2.C R4.1 65.09,37.15 67.31,39.37 R5.1
N$5
  Top 0.406: R8.2 OK1.7
N$6
  Top 0.406: U2.5 5.84,24.76 C1.1
N$7
  Bottom 0.406: OK1.2 22.86,50.63 D1.C 25.08,50.8 R10.2
N$8
  Top 0.406: U2.6 6.76,23.16 5.9,23.16 5.6,22.86 C1.2
N$9
  Top 0.406: R34.1 82.55,26.67 SV6.5
N$10
  Top 0.406: R12.2 R11.1 6.67,21.89 U2.8
N$11
  Top 0.406: R33.1 85.09,24.13 SV6.3
N$12
  Top 0.406: SV6.1 87.63,24.13 87.63,21.59 R32.1
N$13
  Top 0.254: U1.7 30.73,18.8 29.21,20.32
  Top 0.406: Y1.1 25.65,21.52 C7.1 28.26,21.27 29.21,20.32
N$14
  Bottom 0.813: JP2.2 SV7.5
N$15
  Top 0.813: J1.1 48.84,29.21 JP1.1
N$16  (via drill 0.6)
  Top 0.254: SJ1.1 68.07,17.02 67.31,17.78 v64.77,17.78
  Top 0.406: J1.6 v45.72,36.83
  Bottom 0.406: v45.72,36.83 46.99,36.83 47.35,36.47 47.37,36.47 47.9,35.94 47.9,35.92 50.8,33.02 57.15,33.02 59.69,30.48 59.69,22.86 63.86,18.69 63.88,18.69 64.41,18.16 64.41,18.14 v64.77,17.78
N$17
  Bottom 0.406: FB3.2 25.4,55.88 R10.1
N$18
  Bottom 0.406: FB4.2 15.56,50.8 D1.A 20.32,50.63 OK1.3
N$19
  Top 0.406: FB1.1 66.04,39.69 66.04,41.59 R5.2
P_VOL
  Top 0.254: U1.34 60.17,20.8 68.58,29.21
  Top 0.406: 68.58,29.21 82.55,29.21 85.09,31.75 85.09,34.29 SV5.3
POK_3V3  (1 unrouted)
  Top 0.406: 10.48,21.89 U2.1 11,20.52 R31.1 10.8,18.41 11.43,17.78 21.59,17.78 21.59,31.75 27.94,31.75 31.75,35.56 36.83,35.56 39.73,32.66 39.75,32.66 40.28,32.13 40.28,32.11 40.64,31.75 40.64,26.67 43.18,24.13 43.18,22.86 44.07,21.97
RX_C_2  (via drill 0.6)
  Top 0.61: 27.94,49.53 24.13,53.34 SV2.2 | 27.94,49.53 27.94,46.99 29.21,45.72 29.21,44.45 C13.1 | 27.94,49.53 arc90 28.12,49.35 36.17,49.35 X6.2
  Top 1.016: v29.53,45.72 29.21,45.4 29.21,44.45
  other vias: 46.35,58.1 46.35,45.09 12.06,45.72 12.06,58.42 22.23,58.42 29.84,58.42 27.3,53.34 12.06,50.8 22.23,45.09 34.29,52.7 35.24,55.56 24.13,55.88 15.24,49.53
  pour Top (isolate 0.254): 11.43,59.69 11.43,44.45 46.99,44.45 46.99,59.69
  pour Bottom (isolate 0.254): 11.43,59.69 11.43,44.45 46.99,44.45 46.99,59.69
RX_C_4
  Bottom 0.406: SV2.4 20.32,54.61 22.86,54.61 22.86,57.15 27.62,57.15 FB3.1 31.75,55.88 33.02,54.61 33.02,53.66 33.1,53.58 33.1,50.99 33.02,50.91 X6.4
RX_C_5
  Top 0.406: SV2.5 15.24,54.61 15.24,52.07 20.32,52.07 20.32,54.61 27.94,54.61 29.21,55.88 33.02,55.88 43.18,45.72 X6.5
  Bottom 0.406: SV2.5 13.02,55.88 arc90 FB4.1
RX_C_S
  Top 0.61: SV2.6 17.78,54.61 17.78,57.15 | X6.PE X6.PE@ 35.13,57.15 17.78,57.15 | 17.78,57.15 15.24,57.15 13.97,55.88 C14.1
RX_L
  Top 0.254: U1.46 46.47,23.2 46.47,22.37 46.28,22.17 45.03,22.17 45.03,22.28 44.45,22.86
  Top 0.406: OK1.6 R9.1 21.59,36.51 21.59,33.02 27.94,33.02 31.75,36.83 36.83,36.83 41.91,31.75 41.91,26.67 44.45,24.13 44.45,22.86
SCL  (via drill 0.6)
  Top 0.254: U1.15 46.51,13.49 v44.45,11.43
  Bottom 0.406: v44.45,11.43 45.4,12.38 R36.1 46.99,16.53 47.88,17.42 48.64,17.42 49.17,16.89 49.17,16.87 52.07,13.97 85.09,13.97 SV7.4
SDA  (via drill 0.6)
  Top 0.254: U1.16 47.03,14.87 47.03,15.73 47.22,15.93 47.68,15.93 v48.26,16.51
  Bottom 0.406: v48.26,16.51 49.53,15.24 R35.1 51.12,12.38 52.07,13.34 79.69,13.34 81.28,11.43 87.63,11.43 SV7.2
TX_C_4
  Top 0.406: FB2.2 60.96,42.86 60.96,44.88 | 60.96,44.88 60.96,45.09 65.33,49.45 67.23,49.45 73.66,55.88 73.66,57.15 76.2,57.15 76.2,54.61 SV1.4 | X5.4 60.96,44.88
TX_C_5
  Top 0.406: FB1.2 63.5,42.86 X5.5 66.47,44.88 67.94,46.35 67.94,48.9 SV1.5
TX_H_H
  Top 0.406: FB2.1 R7.2 R6.2
TX_L
  Top 0.254: U1.47 46.01,23.25 46.01,24.09 48.57,26.65 57.13,26.65 58.42,27.94
  Top 0.406: 58.42,27.94 58.42,30.48 52.7,36.2 52.38,36.2 R1.1
UNREG+
  Top 0.406: 8.88,22.87 8.88,22.53 U2.7 | 9.21,23.2 10.11,23.2 10.12,23.19 U2.3
  Top 1.016: 9.21,23.2 8.88,22.87 8.88,25.7 C3.1 | C3.1 | C3.1 D2.C
XTALIN
  Top 0.254: U1.6 40.39,19.3 38.1,21.59
  Top 0.406: C8.1 35.31,22.79 Y1.2 | SJ2.2 33.21,22.54 C8.1 | 38.1,21.59 37.15,22.54 C8.1

### Text on the board
Top: TOP
Bottom: BOT
tStop: 03/17 | J. Linn